# EAGLE schematic ESPTempLogger (EAGLE 6.5.0)
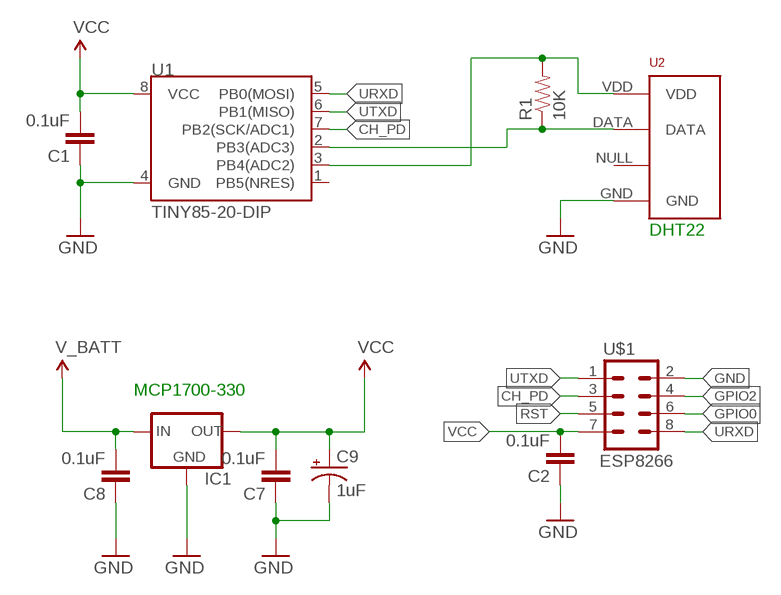
[diagram p0: schematic, sheet 1]

## Parts
C1  0.1uF  CAPPTH  [CAP-PTH-SMALL]
C2  0.1uF  CAPPTH  [CAP-PTH-SMALL]
C7  0.1uF  CAPPTH  [CAP-PTH-SMALL]
C8  0.1uF  CAPPTH  [CAP-PTH-SMALL]
C9  1uF  CAP_POLPTH2  [CPOL-RADIAL-10UF-25V]
IC1  V_REG_78XXTO-92_UNTESTED  [TO-92]
R1  10K  RESISTORPTH-1/4W  [AXIAL-0.4]
U1  TINY85-20-DIP  ATTINY45TINY85-20-DIP  [DIP08]
U2  RHT03_DHT-22_AM2302RA  [RHT03_DHT-22/RA]
U$1  ESP8266  M04X2  [2X4]

## Nets
CH_PD: U1.7(PB2(SCK/ADC1)) U$1.3
GND: C1.1 C2.1 C7.1 C8.1 C9.2(-) IC1.1(GND) U1.4(GND) U2.GND U$1.2
GPIO0: U$1.6
GPIO2: U$1.4
N$1: R1.P$2 U1.3(PB4(ADC2)) U2.VDD
N$2: R1.P$1 U1.2(PB3(ADC3)) U2.DATA
RST: U$1.5
URXD: U1.5(PB0(MOSI)) U$1.8
UTXD: U1.6(PB1(MISO)) U$1.1
V_BATT: C8.2 IC1.2(IN)
VCC: C1.2 C2.2 C7.2 C9.1(+) IC1.3(OUT) U1.8(VCC) U$1.7
Unconnected: U1.1(PB5(NRES)) U2.NULL

## Notes on the sheet
- DHT22
- MCP1700-330

## Library data of the parts
C1 C2 C7 C8 = SparkFun-Capacitors:CAP: Capacitor Standard 0603 ceramic capacitor, and 0.1" leaded capacitor.
C9 = SparkFun-Passives:CAP_POL: Capacitor Polarized These are standard SMD and PTH capacitors. Normally 10uF, 47uF, and 100uF in electrolytic and tantalum varieties. Always verify the external diameter of the through hole cap, it varies with capacity, voltage, and manufacturer. The EIA devices should be standard.
IC1 = SparkFun-PowerIC:V_REG_78XX: Voltage Regulator Standard 7805 5V regulator. IGO (Input Ground Output). Spark Fun Electronics SKU : COM-00107
R1 = SparkFun-Passives:RESISTOR: Resistor Basic schematic elements and footprints for 0603, 1206, and PTH resistors.
U1 = SparkFun-DigitalIC:ATTINY45: Atmel 8-pin 2/4/8kB flash uC; PROD_ID: IC-09445
U2 = RHT03_DHT-22_AM2302:RHT03_DHT-22_AM2302: RHT03 / DHT-22 / AM2302 Packages and symbol for the RHT03 / DHT-22 relative humidity and temperature sensor. Note: The AM2302 is a wired version of the DHT-22 which typically requires less clearance and is thus provided as a separate package.; PROD_ID: SEN-10167
U$1 = SparkFun-Connectors:M04X2: .1" header, two rows of four.